# Altium project ZYNQ-7020-Core.PrjPcb (part 2 of 2)

## Sheet ZYNQ-JTAG.SchDoc
size A3; SheetNumber: 6; SheetTotal: 9
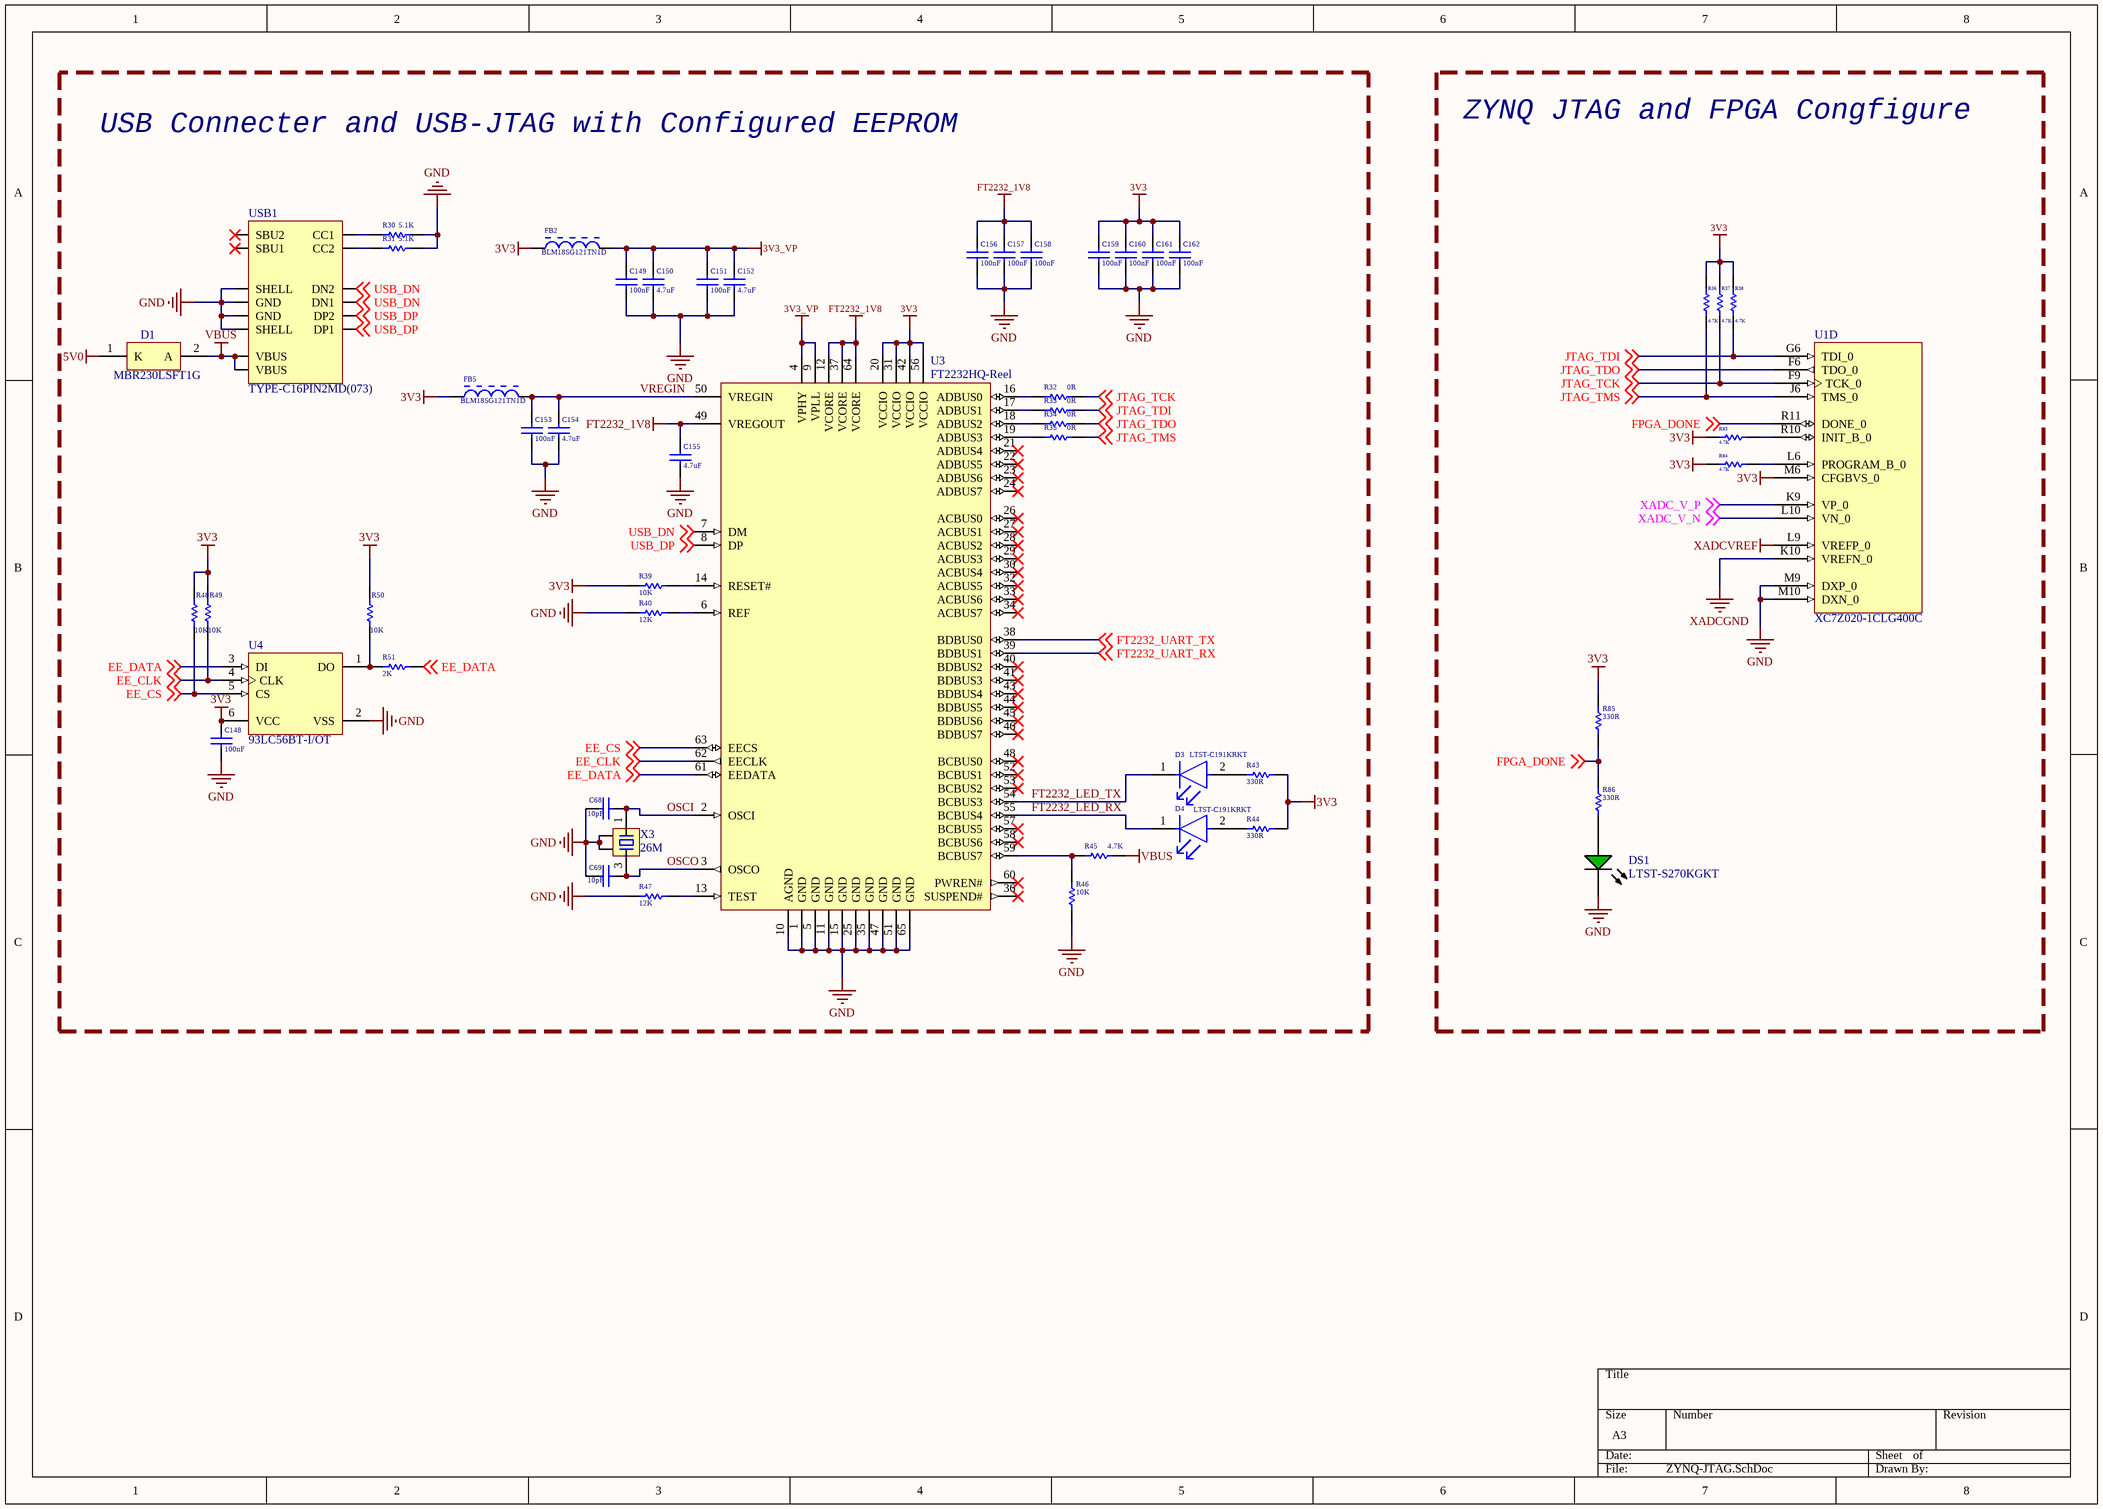
[diagram p5: ZYNQ-JTAG.SchDoc]

### Parts
C68  10pF  [CAPC1005X55X25LL05T10]
C69  10pF  [CAPC1005X55X25LL05T10]
C148  100nF  [CAPC1005X55X25LL05T10]
C149  100nF  [CAPC1005X55X25LL05T10]
C150  4.7uF  [CAPC1005X55X25LL05T10]
C151  100nF  [CAPC1005X55X25LL05T10]
C152  4.7uF  [CAPC1005X55X25LL05T10]
C153  100nF  [CAPC1005X55X25LL05T10]
C154  4.7uF  [CAPC1005X55X25LL05T10]
C155  4.7uF  [CAPC1005X55X25LL05T10]
C156  100nF  [CAPC1005X55X25LL05T10]
C157  100nF  [CAPC1005X55X25LL05T10]
C158  100nF  [CAPC1005X55X25LL05T10]
C159  100nF  [CAPC1005X55X25LL05T10]
C160  100nF  [CAPC1005X55X25LL05T10]
C161  100nF  [CAPC1005X55X25LL05T10]
C162  100nF  [CAPC1005X55X25LL05T10]
D1  MBR230LSFT1G  [ONSC-SOD-123FL-2-498-01_V]
D3  LTST-C191KRKT  [FP-LTST-C191KRKT-MFG]
D4  LTST-C191KRKT  [FP-LTST-C191KRKT-MFG]
DS1  LTST-S270KGKT  [LTST-LTST-S270KGKT-2_V]
FB2  BLM18SG121TN1D  [MURA-BLM18SG-B40-CHIP-2_V6]
FB5  BLM18SG121TN1D  [MURA-BLM18SG-B40-CHIP-2_V6]
R30  5.1K  [RESC1005X40X25LL05T05]
R31  5.1K  [RESC1005X40X25LL05T05]
R32  0R  [RESC1005X40X25LL05T05]
R33  0R  [RESC1005X40X25LL05T05]
R34  0R  [RESC1005X40X25LL05T05]
R35  0R  [RESC1005X40X25LL05T05]
R36  4.7K  [RESC1005X40X25LL05T05]
R37  4.7K  [RESC1005X40X25LL05T05]
R38  4.7K  [RESC1005X40X25LL05T05]
R39  10K  [RESC1005X40X25LL05T05]
R40  12K  [RESC1005X40X25LL05T05]
R43  330R  [RESC1005X40X25LL05T05]
R44  330R  [RESC1005X40X25LL05T05]
R45  4.7K  [RESC1005X40X25LL05T05]
R46  10K  [RESC1005X40X25LL05T05]
R47  12K  [RESC1005X40X25LL05T05]
R48  10K  [RESC1005X40X25LL05T05]
R49  10K  [RESC1005X40X25LL05T05]
R50  10K  [RESC1005X40X25LL05T05]
R51  2K  [RESC1005X40X25LL05T05]
R83  4.7K  [RESC1005X40X25LL05T05]
R84  4.7K  [RESC1005X40X25LL05T05]
R85  330R  [RESC1005X40X25LL05T05]
R86  330R  [RESC1005X40X25LL05T05]
U1  XC7Z020-1CLG400C  [CLG400]  (part D of 9)
U3  FT2232HQ-Reel  [QFN64_2_L]
U4  93LC56BT-I/OT  [SOT-23-OT6_N]
USB1  TYPE-C16PIN2MD(073)  [TYPE-C16PIN2MD(073)-Footprint]
X3  26M  [XTAL-3225-4P]

### Blocks framed on the sheet
USB Connecter and USB-JTAG with Configured EEPROM: C68 C69 C148-C162 D1 D3 D4 FB2 FB5 R30-R35 R39 R40 R43-R51 U3 U4 USB1 X3
ZYNQ JTAG and FPGA Congfigure: DS1 R36-R38 R83-R86 U1

### Nets
3V3: C148.1 C159.1 C160.1 C161.1 C162.1 FB2.1 FB5.1 R36.1 R37.1 R38.1 R39.2 R43.1 R44.1 R48.2 R49.2 R50.2 R83.1 R84.1 R85.2 U1.M6(CFGBVS_0) U3.20(VCCIO) U3.31(VCCIO) U3.42(VCCIO) U3.56(VCCIO) U4.6(VCC)
3V3_VP: C149.1 C150.1 C151.1 C152.1 FB2.2 U3.4(VPHY) U3.9(VPLL)
5V0: D1.1(K)
FT2232_1V8: C155.1 C156.1 C157.1 C158.1 U3.12(VCORE) U3.37(VCORE) U3.49(VREGOUT) U3.64(VCORE)
GND: C68.2 C69.2 C148.2 C149.2 C150.2 C151.2 C152.2 C153.2 C154.2 C155.2 C156.2 C157.2 C158.2 C159.2 C160.2 C161.2 C162.2 DS1.1(K) R30.1 R31.1 R40.1 R46.1 R47.1 U1.M9(DXP_0) U1.M10(DXN_0) U3.1(GND) U3.5(GND) U3.10(AGND) U3.11(GND) U3.15(GND) U3.25(GND) U3.35(GND) U3.47(GND) U3.51(GND) U3.65(GND) U4.2(VSS) USB1.1(GND) USB1.12(GND) USB1.13(SHELL) USB1.14(SHELL) X3.2 X3.4
VBUS: D1.2(A) R45.2 USB1.2(VBUS) USB1.11(VBUS)
XADCGND: U1.K10(VREFN_0)
XADCVREF: U1.L9(VREFP_0)
EE_CLK: R49.1 U3.62(EECLK) U4.4(CLK) ; off-sheet EE_CLK
EE_CS: R48.1 U3.63(EECS) U4.5(CS) ; off-sheet EE_CS
EE_DATA: R51.1 U3.61(EEDATA) U4.3(DI) ; off-sheet EE_DATA
FPGA_DONE: R85.1 R86.2 U1.R11(DONE_0) ; off-sheet FPGA_DONE
FT2232_LED_RX: D4.1(C) U3.55(BCBUS4)
FT2232_LED_TX: D3.1(C) U3.54(BCBUS3)
FT2232_UART_RX: U3.39(BDBUS1) ; off-sheet FT2232_UART_RX
FT2232_UART_TX: U3.38(BDBUS0) ; off-sheet FT2232_UART_TX
JTAG_TCK: R32.2 R37.2 U1.F9(TCK_0) ; off-sheet JTAG_TCK
JTAG_TDI: R33.2 R38.2 U1.G6(TDI_0) ; off-sheet JTAG_TDI
JTAG_TDO: R34.2 U1.F6(TDO_0) ; off-sheet JTAG_TDO
JTAG_TMS: R35.2 R36.2 U1.J6(TMS_0) ; off-sheet JTAG_TMS
OSCI: C68.1 U3.2(OSCI) X3.1
OSCO: C69.1 U3.3(OSCO) X3.3
USB_DN: U3.7(DM) USB1.5(DN2) USB1.7(DN1) ; off-sheet USB_DN
USB_DP: U3.8(DP) USB1.6(DP1) USB1.8(DP2) ; off-sheet USB_DP
VREGIN: C153.1 C154.1 FB5.2 U3.50(VREGIN)
XADC_V_N: U1.L10(VN_0) ; off-sheet XADC_V_N
XADC_V_P: U1.K9(VP_0) ; off-sheet XADC_V_P
NetD3_2: D3.2(A) R43.2
NetD4_2: D4.2(A) R44.2
NetDS1_2: DS1.2(A) R86.1
NetR30_2: R30.2 USB1.4(CC1)
NetR31_2: R31.2 USB1.10(CC2)
NetR32_1: R32.1 U3.16(ADBUS0)
NetR33_1: R33.1 U3.17(ADBUS1)
NetR34_1: R34.1 U3.18(ADBUS2)
NetR35_1: R35.1 U3.19(ADBUS3)
NetR39_1: R39.1 U3.14(RESET#)
NetR40_2: R40.2 U3.6(REF)
NetR45_1: R45.1 R46.2 U3.59(BCBUS7)
NetR47_2: R47.2 U3.13(TEST)
NetR50_1: R50.1 R51.2 U4.1(DO)
NetR83_2: R83.2 U1.R10(INIT_B_0)
NetR84_2: R84.2 U1.L6(PROGRAM_B_0)

Not connected (* = marked no-connect by the designer): U3 21(ADBUS4)* 22(ADBUS5)* 23(ADBUS6)* 24(ADBUS7)* 26(ACBUS0)* 27(ACBUS1)* 28(ACBUS2)* 29(ACBUS3)* 30(ACBUS4)* 32(ACBUS5)* 33(ACBUS6)* 34(ACBUS7)* 36(SUSPEND#)* 40(BDBUS2)* 41(BDBUS3)* 43(BDBUS4)* 44(BDBUS5)* 45(BDBUS6)* 46(BDBUS7)* 48(BCBUS0)* 52(BCBUS1)* 53(BCBUS2)* 57(BCBUS5)* 58(BCBUS6)* 60(PWREN#)*; USB1 3(SBU2)* 9(SBU1)*

### Library data of the parts
C68 C69 C148-C162 = CMP-2008-04639-1: Part Number: GRM155R71H104KE14D; Manufacturer: Murata
D1 = CMP-1055-00442-1: Schottky Power Rectifier, 2-Pin SOD-123, Pb-Free, Tape and Reel; Manufacturer: On Semiconductor; Configuration: Single; IFSM Max (A): 40; ComponentLink2Description: Datasheet; DatasheetVersion: Rev. 0; ComponentLink1URL: http://www.onsemi.com/; ComponentLink2URL: http://www.onsemi.cn/pub_link/Collateral/MBR230LSFT1G.PDF; ComponentLink3Description: Package Specification; PackageDescription: 2-Pin SOD, Body 1.65 x 2.7 mm; RoHS: TRUE; PackageVersion: Rev. A; Mounting Technology: Surface Mount; ComponentLink3URL: http://www.onsemi.cn/pub_link/Collateral/MBR120VLSFT1-D.PDF; ComponentLink1Description: Manufacturer URL; Packing: Tape and Reel; PackageReference: SOD-123FL-2-498-01; PartNumber: MBR230LSFT1G
D3 D4 = CMP-2000-05199-2
DS1 = CMP-2000-06629-1: Ultra Bright AlInGaP Chip LED, 75 mW, -30 to 85 degC, 2-Pin SMD (0604), RoHS, Tape and Reel; Manufacturer: Lite-On; Luminous Intensity: 71mcd; Reverse Voltage: 5V; Power Dissipation: 75W; Viewing Angle: 130deg; Shape Type: Rectangular; DELETED: Compliant; Type: Uni-Color; Peak Wavelength: 574nm; Forward Current Max: 30mA; Emitting Color: YellowGreen; Number of  Elements: 1; Forward Voltage: 2.4V; Product Depth (mm): 0.6mm; Power Dissipation Max: 75mW; Dominant Wave Length: 571nm; Product Length (mm): 1.6mm; Chip Material: AlGaInP; Product Height (mm): 1.15mm; Rad Hardened: No; High Brightness: Yes; Test Current (It): 20mA; Main Category: ChipLED; Mounting: SurfaceMount; Operating Temperature Classification: Industrial; Mounting Technology: SurfaceMount; Packaging: TapeandReel; Datasheet URL: http://optoelectronics.liteon.com/upload/download/DS22-2000-226/S_110_LTST-S270KGKT.pdf; Package Type: ChipLed; Datasheet Version: Rev. I, 04/2012; Forward Current: 30mA; Operating Temp Range: -55Cto85C; Lens Dimensions: 1.2X0.6X0.47mm; Pin Count: 2; Manufacturer URL: http://www.us.liteon.com/; Lum Intensity: 71mcd; Package Reference: LTST-S270KGKT-2; Package Description: 2-Pin Surface Mounted Device, Body 1.65 x 0.6 mm
FB2 FB5 = CMP-0686-00602-3: Chip Ferrite Bead for Power Lines (Low DC Resistance Type), 120 Ohm, 3000 mA, -55 to 125 degC, 1.6 x 0.8 x 0.65 mm SMD, Tape and Reel; Manufacturer: Murata; Impedance (at 100 MHz): 120 Ohm +/- 25%; Rated Current: 3000 mA; DC Resistance: 0.025 Ohm Max.; ComponentLink3Description: Package Specification; PackageReference: BLM18_H650-2; DatasheetVersion: 08/2013; Packing: Tape and Reel; PartNumber: BLM18SG121TN1D; PackageDescription: 2-Pin Chip, Body 1.6 x 0.8 mm; ComponentLink2Description: Datasheet; ComponentLink3URL: http://www.murata.com/products/catalog/pdf/c31e.pdf; ComponentLink1URL: http://www.murata.com/; Operating Temperature Range: -55 to 125 degC; Mounting Technology: Surface Mount; ComponentLink2URL: http://www.murata.com/products/catalog/pdf/c31e.pdf; ComponentLink1Description: Manufacturer URL
R30-R40 R43-R51 R83-R86 = CMP-2002-00921-1: Manufacturer: Panasonic; Part Number: ERJ-2RKF40R2X
U1 = CMP-0363-00002-3: 667 MHz Zynq™-7000 AP SoC, 130 PS I/O, 125 FPGA I/O, 400-Ball BGA, Speed Grade 1, Commercial Grade, Pb-Free; Flip Flops: 106400; Speed Grade: -1; LUTs: 53200; Extensible Block RAM (# 36Kb Blocks): 560 KB (140); PackageVersion: Rev 1.1, 09/2012; ComponentLink1Description: Datasheet; ComponentLink2Description: Package Specification; ComponentLink6Description: PCB and Layout Guide; PackageDescription: Wire-Bond Chip-Scale BGA, Body 17 x 17 mm, 0.8 mm Pitch; RoHS: Pb-Free; DatasheetVersion: v1.2; Mounting Technology: Surface Mount; ComponentLink5Description: Packaging and Pinout; ComponentLink5URL: http://www.xilinx.com/support/documentation/user_guides/ug865-Zynq-7000-Pkg-Pinout.pdf; ComponentLink6URL: http://www.xilinx.com/support/documentation/user_guides/ug483_7Series_PCB.pdf; Generic Part Number: XC7Z020; ComponentLink3Description: DC and AC Switching Characteristics; ComponentLink2URL: http://www.xilinx.com/support/documentation/user_guides/ug865-Zynq-7000-Pkg-Pinout.pdf; ComponentLink4Description: Package File; ComponentLink1URL: http://www.xilinx.com/support/documentation/data_sheets/ds190-Zynq-7000-Overview.pdf; PackageReference: CLG400; ComponentLink3URL: http://www.xilinx.com/support/documentation/data_sheets/ds187-XC7Z010-XC7Z020-Data-Sheet.pdf; PartNumber: XC7Z020-1CLG400C; ComponentLink4URL: http://www.xilinx.com/support/packagefiles/z7packages/xc7z020clg400pkg.txt; Code_JEDEC: MO-275-MMAA-1
U3 = CMP-0078-00004-3: Dual High Speed USB To Multipurpose UART/FIFO IC, 64-pin QFN, Tape and Reel; Manufacturer: FTDI; ComponentLink2Description: Datasheet; RevisionNote: DatasheetVersion updated to 2.21 Jun-2012; ComponentLink2URL: http://www.ftdichip.com/Support/Documents/DataSheets/ICs/DS_FT2232H.pdf; PackageReference: QFN64_2; ComponentLink1Description: Manufacturer URL; PackageDescription: 64-Pin Quad Flat No-Lead, 9 x 9 mm Body, 0.5 mm Pitch, 4.35 x 4.35 mm Exposed Pad; PackageVersion: Jun-12; DatasheetVersion: ver 2.21, Jun-2012; PartNumber: FT2232HQ-Reel; ComponentLink1URL: http://www.ftdichip.com/
U4 = CMP-0162-00356-1: 2K, 128x16-bit, 2.5V Microwire Serial EEPROM, 6-Pin SOT-23, Industrial Temperature, Tape and Reel; DatasheetVersion: revF, May-2008; Code_IPC: SOT26A-6; PackageReference: SOT-23-OT6; PackageVersion: revBB, Aug-2009; PackageDescription: 6-Lead Plastic Small Outline Transistor (OT) [SOT-23]
USB1 = CMP-00018-3: Type-C 母 卧贴 带定位柱 不锈钢外壳 2次模顶; 商品目录: USB连接器; 触点数量: 16P; 额定电流 - 电源: 5A; 端口数量: 1; 工作温度范围: -25℃~+85℃; 公母: 母; 安装方式: 卧贴; 连接器类型: Type-C; 标准: -
X3 = XTAL-4P: 4脚无源晶振(谐振器）; 联系下单店铺卖家 免费帮你查找封装: 联系下单店铺卖家 免费技术支持; BOM名称: 4脚无源晶振(谐振器）

## Sheet Board-Power.SchDoc
size A3; SheetNumber: 7; SheetTotal: 9
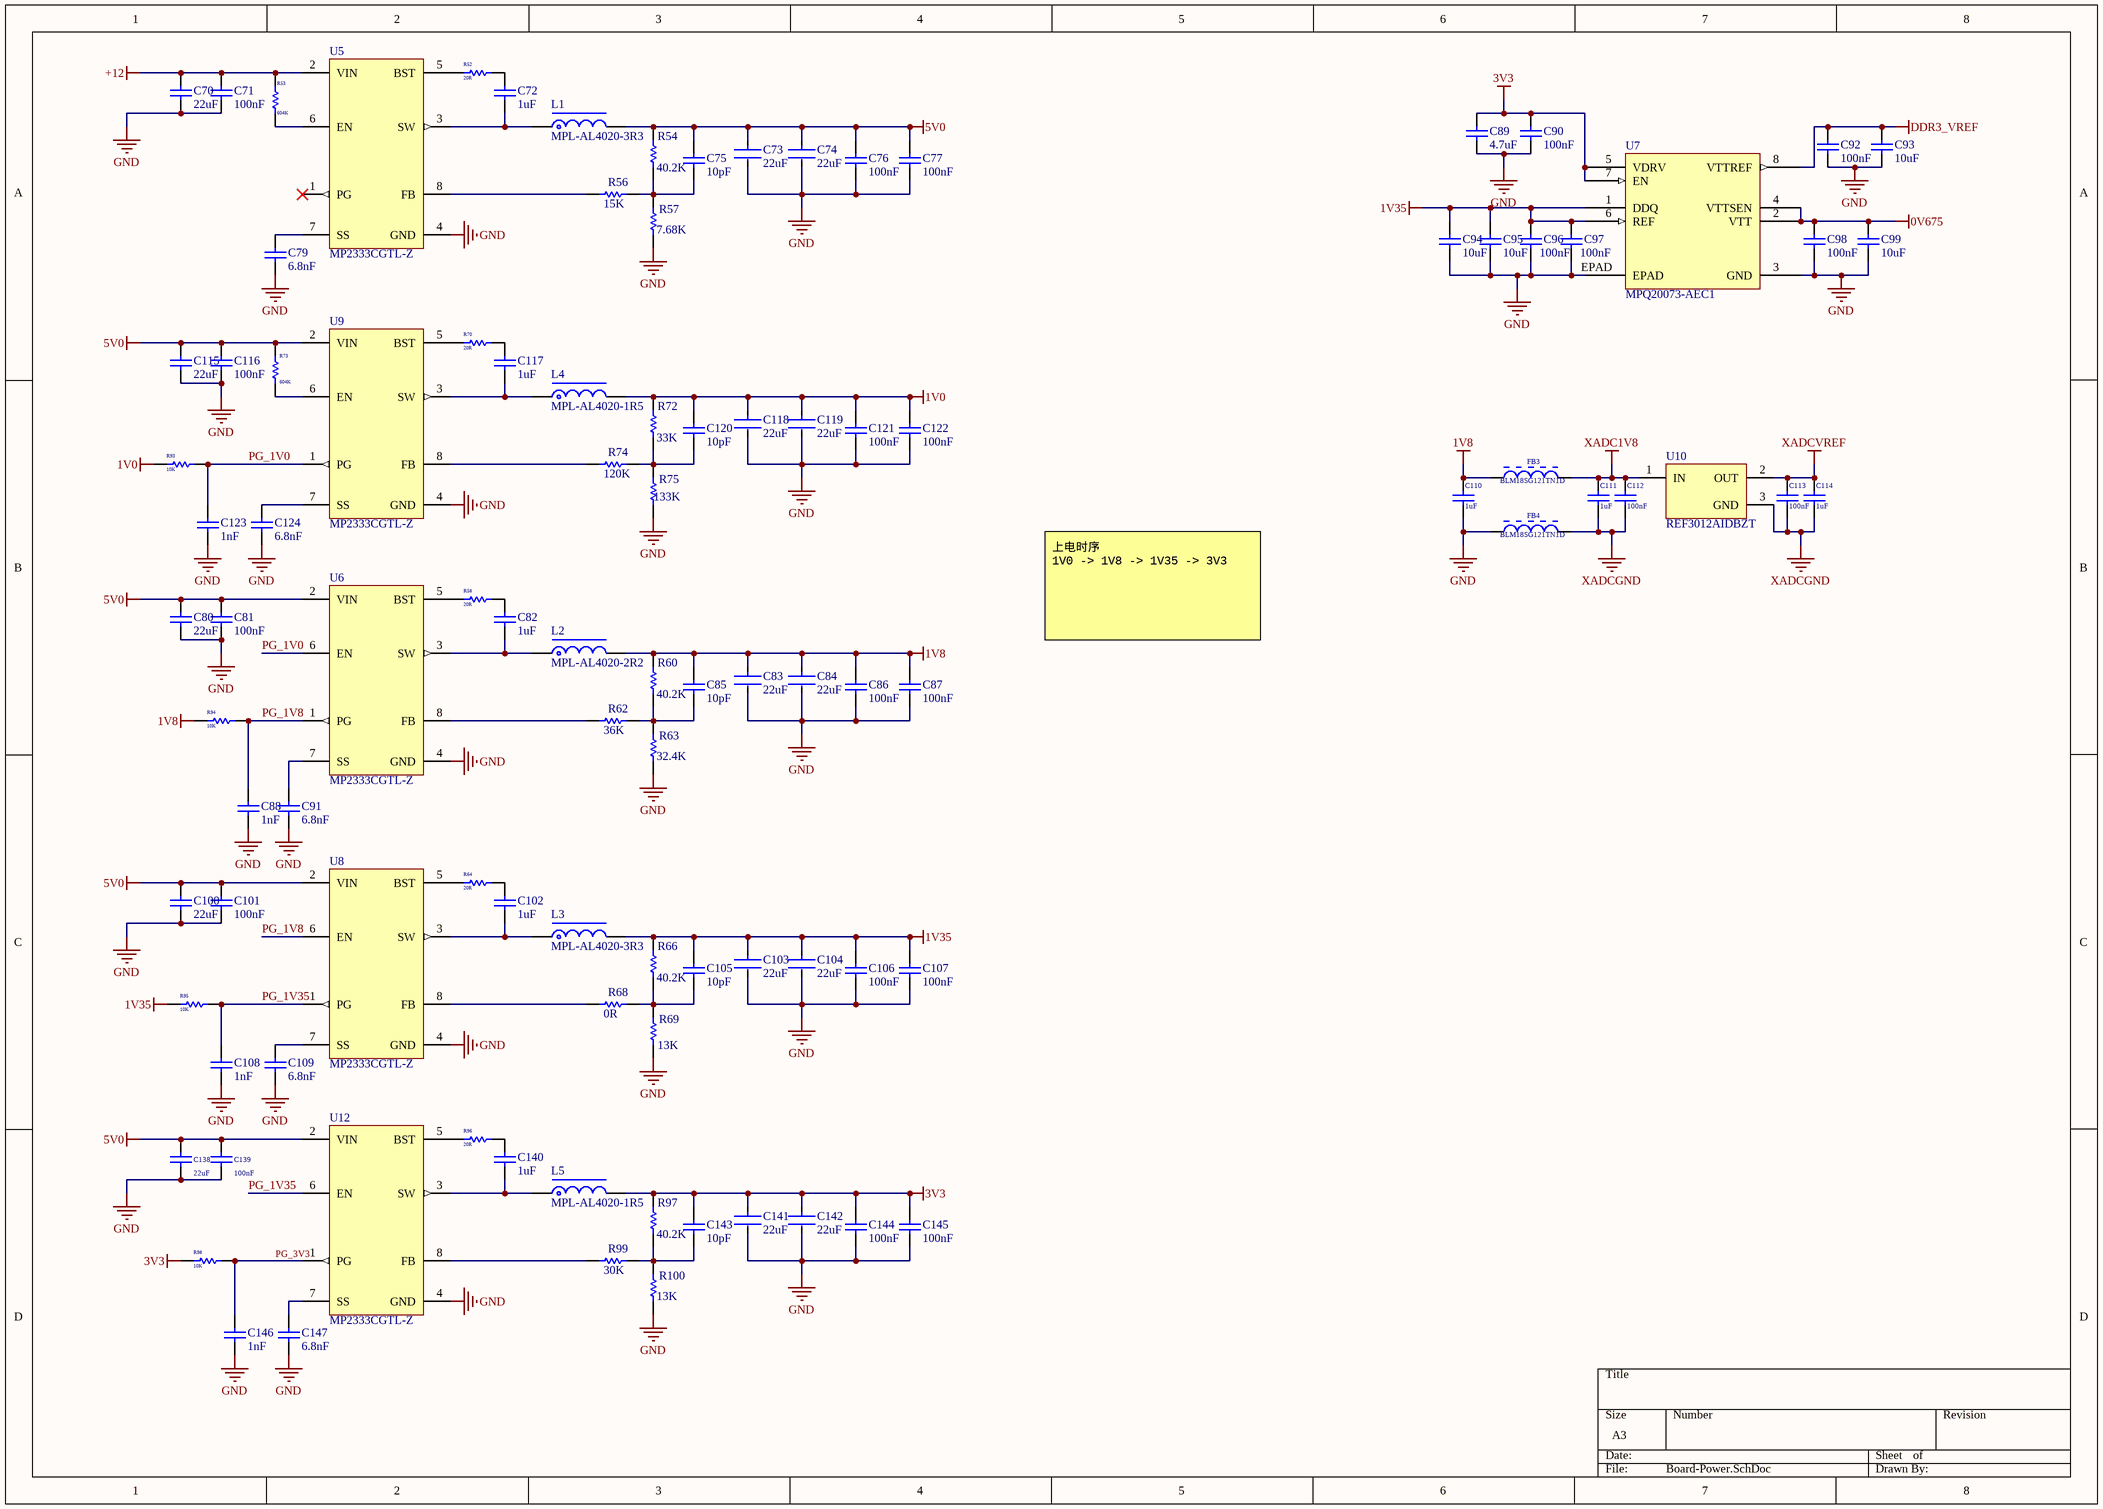
[diagram p6: Board-Power.SchDoc]

### Parts
C70  22uF  [CAPC2013X145X45LL20T25]
C71  100nF  [CAPC1005X55X25LL05T10]
C72  1uF  [CAPC1005X55X25LL05T10]
C73  22uF  [FP-GCM31C-0_2-e0_3_0_8-IPC_C]
C74  22uF  [FP-GCM31C-0_2-e0_3_0_8-IPC_C]
C75  10pF  [CAPC1005X55X25LL05T10]
C76  100nF  [CAPC1005X55X25LL05T10]
C77  100nF  [CAPC1005X55X25LL05T10]
C79  6.8nF  [CAPC1005X55X25LL05T10]
C80  22uF  [CAPC2013X145X45LL20T25]
C81  100nF  [CAPC1005X55X25LL05T10]
C82  1uF  [CAPC1005X55X25LL05T10]
C83  22uF  [FP-GCM31C-0_2-e0_3_0_8-IPC_C]
C84  22uF  [FP-GCM31C-0_2-e0_3_0_8-IPC_C]
C85  10pF  [CAPC1005X55X25LL05T10]
C86  100nF  [CAPC1005X55X25LL05T10]
C87  100nF  [CAPC1005X55X25LL05T10]
C88  1nF  [CAPC1005X55X25LL05T10]
C89  4.7uF  [CAPC1005X55X25LL05T10]
C90  100nF  [CAPC1005X55X25LL05T10]
C91  6.8nF  [CAPC1005X55X25LL05T10]
C92  100nF  [CAPC1005X55X25LL05T10]
C93  10uF  [MURA-1206_H_1.8_L]
C94  10uF  [MURA-1206_H_1.8_L]
C95  10uF  [MURA-1206_H_1.8_L]
C96  100nF  [CAPC1005X55X25LL05T10]
C97  100nF  [CAPC1005X55X25LL05T10]
C98  100nF  [CAPC1005X55X25LL05T10]
C99  10uF  [MURA-1206_H_1.8_L]
C100  22uF  [CAPC2013X145X45LL20T25]
C101  100nF  [CAPC1005X55X25LL05T10]
C102  1uF  [CAPC1005X55X25LL05T10]
C103  22uF  [FP-GCM31C-0_2-e0_3_0_8-IPC_C]
C104  22uF  [FP-GCM31C-0_2-e0_3_0_8-IPC_C]
C105  10pF  [CAPC1005X55X25LL05T10]
C106  100nF  [CAPC1005X55X25LL05T10]
C107  100nF  [CAPC1005X55X25LL05T10]
C108  1nF  [CAPC1005X55X25LL05T10]
C109  6.8nF  [CAPC1005X55X25LL05T10]
C110  1uF  [CAPC1005X55X25LL05T10]
C111  1uF  [CAPC1005X55X25LL05T10]
C112  100nF  [CAPC1005X55X25LL05T10]
C113  100nF  [CAPC1005X55X25LL05T10]
C114  1uF  [CAPC1005X55X25LL05T10]
C115  22uF  [CAPC2013X145X45LL20T25]
C116  100nF  [CAPC1005X55X25LL05T10]
C117  1uF  [CAPC1005X55X25LL05T10]
C118  22uF  [FP-GCM31C-0_2-e0_3_0_8-IPC_C]
C119  22uF  [FP-GCM31C-0_2-e0_3_0_8-IPC_C]
C120  10pF  [CAPC1005X55X25LL05T10]
C121  100nF  [CAPC1005X55X25LL05T10]
C122  100nF  [CAPC1005X55X25LL05T10]
C123  1nF  [CAPC1005X55X25LL05T10]
C124  6.8nF  [CAPC1005X55X25LL05T10]
C138  22uF  [CAPC2013X145X45LL20T25]
C139  100nF  [CAPC1005X55X25LL05T10]
C140  1uF  [CAPC1005X55X25LL05T10]
C141  22uF  [FP-GCM31C-0_2-e0_3_0_8-IPC_C]
C142  22uF  [FP-GCM31C-0_2-e0_3_0_8-IPC_C]
C143  10pF  [CAPC1005X55X25LL05T10]
C144  100nF  [CAPC1005X55X25LL05T10]
C145  100nF  [CAPC1005X55X25LL05T10]
C146  1nF  [CAPC1005X55X25LL05T10]
C147  6.8nF  [CAPC1005X55X25LL05T10]
FB3  BLM18SG121TN1D  [MURA-BLM18SG-B40-CHIP-2_V6]
FB4  BLM18SG121TN1D  [MURA-BLM18SG-B40-CHIP-2_V6]
L1  MPL-AL4020-3R3  [MPL-AL4020]
L2  MPL-AL4020-2R2  [MPL-AL4020]
L3  MPL-AL4020-3R3  [MPL-AL4020]
L4  MPL-AL4020-1R5  [MPL-AL4020]
L5  MPL-AL4020-1R5  [MPL-AL4020]
R52  20R  [RESC1005X40X25LL05T05]
R53  604K  [RESC1005X40X25LL05T05]
R54  40.2K  [RESC1005X40X25LL05T05]
R56  15K  [RESC1005X40X25LL05T05]
R57  7.68K  [RESC1005X40X25LL05T05]
R58  20R  [RESC1005X40X25LL05T05]
R60  40.2K  [RESC1005X40X25LL05T05]
R62  36K  [RESC1005X40X25LL05T05]
R63  32.4K  [RESC1005X40X25LL05T05]
R64  20R  [RESC1005X40X25LL05T05]
R66  40.2K  [RESC1005X40X25LL05T05]
R68  0R  [RESC1005X40X25LL05T05]
R69  13K  [RESC1005X40X25LL05T05]
R70  20R  [RESC1005X40X25LL05T05]
R72  33K  [RESC1005X40X25LL05T05]
R73  604K  [RESC1005X40X25LL05T05]
R74  120K  [RESC1005X40X25LL05T05]
R75  133K  [RESC1005X40X25LL05T05]
R93  10K  [RESC1005X40X25LL05T05]
R94  10K  [RESC1005X40X25LL05T05]
R95  10K  [RESC1005X40X25LL05T05]
R96  20R  [RESC1005X40X25LL05T05]
R97  40.2K  [RESC1005X40X25LL05T05]
R98  10K  [RESC1005X40X25LL05T05]
R99  30K  [RESC1005X40X25LL05T05]
R100  13K  [RESC1005X40X25LL05T05]
U5  MP2333CGTL-Z  [SOT583_MP2333C_MNP]
U6  MP2333CGTL-Z  [SOT583_MP2333C_MNP]
U7  MPQ20073-AEC1  [MSOP-8-EP_MNP-L]
U8  MP2333CGTL-Z  [SOT583_MP2333C_MNP]
U9  MP2333CGTL-Z  [SOT583_MP2333C_MNP]
U10  REF3012AIDBZT  [DBZ0003A_L]
U12  MP2333CGTL-Z  [SOT583_MP2333C_MNP]

### Nets
0V675: C98.2 C99.2 U7.2(VTT) U7.4(VTTSEN)
1V0: C118.1 C119.1 C120.2 C121.2 C122.2 L4.2 R72.1 R93.2
1V8: C83.1 C84.1 C85.2 C86.2 C87.2 C110.2 FB3.1 L2.2 R60.1 R94.2
1V35: C94.2 C95.2 C96.2 C97.2 C103.1 C104.1 C105.2 C106.2 C107.2 L3.2 R66.1 R95.2 U7.1(DDQ) U7.6(REF)
3V3: C89.2 C90.2 C141.1 C142.1 C143.2 C144.2 C145.2 L5.2 R97.1 R98.2 U7.5(VDRV) U7.7(EN)
5V0: C73.1 C74.1 C75.2 C76.2 C77.2 C80.2 C81.2 C100.2 C101.2 C115.2 C116.2 C138.2 C139.2 L1.2 R54.1 R73.2 U6.2(VIN) U8.2(VIN) U9.2(VIN) U12.2(VIN)
+12: C70.2 C71.2 R53.2 U5.2(VIN)
DDR3_VREF: C92.2 C93.2 U7.8(VTTREF)
GND: C70.1 C71.1 C73.2 C74.2 C76.1 C77.1 C79.2 C80.1 C81.1 C83.2 C84.2 C86.1 C87.1 C88.2 C89.1 C90.1 C91.2 C92.1 C93.1 C94.1 C95.1 C96.1 C97.1 C98.1 C99.1 C100.1 C101.1 C103.2 C104.2 C106.1 C107.1 C108.2 C109.2 C110.1 C115.1 C116.1 C118.2 C119.2 C121.1 C122.1 C123.2 C124.2 C138.1 C139.1 C141.2 C142.2 C144.1 C145.1 C146.2 C147.2 FB4.1 R57.2 R63.2 R69.2 R75.2 R100.2 U5.4(GND) U6.4(GND) U7.3(GND) U7.EPAD U8.4(GND) U9.4(GND) U12.4(GND)
XADC1V8: C111.2 C112.2 FB3.2 U10.1(IN)
XADCGND: C111.1 C112.1 C113.1 C114.1 FB4.2 U10.3(GND)
XADCVREF: C113.2 C114.2 U10.2(OUT)
PG_1V0: C123.1 R93.1 U6.6(EN) U9.1(PG)
PG_1V8: C88.1 R94.1 U6.1(PG) U8.6(EN)
PG_1V35: C108.1 R95.1 U8.1(PG) U12.6(EN)
PG_3V3: C146.1 R98.1 U12.1(PG)
NetC72_1: C72.1 L1.1 U5.3(SW)
NetC72_2: C72.2 R52.1
NetC75_1: C75.1 R54.2 R56.2 R57.1
NetC79_1: C79.1 U5.7(SS)
NetC82_1: C82.1 L2.1 U6.3(SW)
NetC82_2: C82.2 R58.1
NetC85_1: C85.1 R60.2 R62.2 R63.1
NetC91_1: C91.1 U6.7(SS)
NetC102_1: C102.1 L3.1 U8.3(SW)
NetC102_2: C102.2 R64.1
NetC105_1: C105.1 R66.2 R68.2 R69.1
NetC109_1: C109.1 U8.7(SS)
NetC117_1: C117.1 L4.1 U9.3(SW)
NetC117_2: C117.2 R70.1
NetC120_1: C120.1 R72.2 R74.2 R75.1
NetC124_1: C124.1 U9.7(SS)
NetC140_1: C140.1 L5.1 U12.3(SW)
NetC140_2: C140.2 R96.1
NetC143_1: C143.1 R97.2 R99.2 R100.1
NetC147_1: C147.1 U12.7(SS)
NetR52_2: R52.2 U5.5(BST)
NetR53_1: R53.1 U5.6(EN)
NetR56_1: R56.1 U5.8(FB)
NetR58_2: R58.2 U6.5(BST)
NetR62_1: R62.1 U6.8(FB)
NetR64_2: R64.2 U8.5(BST)
NetR68_1: R68.1 U8.8(FB)
NetR70_2: R70.2 U9.5(BST)
NetR73_1: R73.1 U9.6(EN)
NetR74_1: R74.1 U9.8(FB)
NetR96_2: R96.2 U12.5(BST)
NetR99_1: R99.1 U12.8(FB)

Not connected (* = marked no-connect by the designer): U5 1(PG)*

### Notes on the sheet
- 上电时序
  1V0 -> 1V8 -> 1V35 -> 3V3

### Library data of the parts
C70 C80 C100 C115 C138 = CMP-2007-03222-1: GRM21BR61E226ME44L; Manufacturer: Murata; Part Number: GRM21BR61E226ME44L
C71 C72 C75-C77 C79 C81 C82 C85-C92 C96-C98 C101 C102 C105-C114 C116 C117 C120-C124 C139 C140 C143-C147 = CMP-2008-04639-1: as C68 on sheet ZYNQ-JTAG
C73 C74 C83 C84 C103 C104 C118 C119 C141 C142 = CMP-00080-1: GCM31CR71A226KE02K / Cap, Aec-Q200, 22Uf, 10V, Mlcc, 1206 Rohs Compliant: Yes; RoHS Compliant: Yes
C93-C95 C99 = CMP-2000-05256-1: GRM31CR61H106KA12L / CAP, Ceramic, 10 uF, 10%, 50 V, 1206, RoHS, Tape and Reel; Manufacturer: Murata; Dielectric: X5R; Case Height: 1.6mm; Type: GeneralPurposeMLCC; Voltage Rating DC: 50V; Brand: MurataElectronics; Case Length: 3.2mm; Case Code - mm: 3216; Manufacturer URL: http://www.murata.com/; Product: GeneralTypeMLCCs; RoHS: Details; Minimum Operating Temperature: -55C; Factory Pack Quantity: 2000; Maximum Operating Temperature: +85C; Case Width: 1.6mm; Series: GRM; Package / Case: 1206(3216metric); Tolerance: 10%; Capacitance: 10uF; Datasheet URL: http://download.siliconexpert.com/pdfs/2015/11/6/15/23/32/328/mrt_/manual/2905595417290350grm31cr61h106ka1223.pdf; Product Category: MultilayerCeramicCapacitorsMLCC-SMD/SMT; Packaging: Reel; Termination Style: SMD/SMT; Datasheet Version: Nov-15; Case Code - in: 1206
FB3 FB4 = CMP-0686-00602-3: as FB2 on sheet ZYNQ-JTAG; ComponentLink3Description: Package Specification; PackageReference: BLM18_H650-2; DatasheetVersion: 08/2013; Packing: Tape and Reel; PartNumber: BLM18SG121TN1D; PackageDescription: 2-Pin Chip, Body 1.6 x 0.8 mm; ComponentLink2Description: Datasheet; ComponentLink3URL: http://www.murata.com/products/catalog/pdf/c31e.pdf; ComponentLink1URL: http://www.murata.com/; Operating Temperature Range: -55 to 125 degC; Mounting Technology: Surface Mount; ComponentLink2URL: http://www.murata.com/products/catalog/pdf/c31e.pdf; ComponentLink1Description: Manufacturer URL
L1-L5 = L-Molding Choke: 一体成型电感; 当前库版本V2023.5.31 @淘宝卖家:黄晶宝石: 最新版本发布https://item.taobao.com/item.htm?id=566775463719; BOM名称: 一体成型电感
R52-R54 R56-R58 R60 R62-R64 R66 R68-R70 R72-R75 R93-R100 = CMP-2002-00921-1: as R30 on sheet ZYNQ-JTAG
U5 U6 U8 U9 U12 = CMP-00056-5: Switching Voltage Regulators 3A, 18V, 650kHz, Force CCM, Synchronous Step-Down C
U7 = CMP-00079-2: 2A 1.3V–6.0V DDR Memory Termination Regulator AEC-Q100 Qualified
U10 = CMP-0367-00158-2: 1.25 V, 50 ppm / degC, 50 uA Series (Bandgap) Voltage Reference, -40 to 125 degC, 3-pin SOT-23 (DBZ), Green (RoHS & no Sb/Br); Manufacturer: Texas Instruments; Iq(Max)(uA): 50; Initial Accuracy @ 25/deg C(%): 0.2; Rating: Catalog; VI(Max)(V): 5.5; VI(Min)(V): 1.8; Temp Coeff(Typ)(ppm/ degree C): 20; SubFamily: Series Voltage Reference; VO(V): 1.25; ComponentLink1Description: Manufacturer URL; ComponentLink1URL: http://www.ti.com/; PartNumber: REF3012AIDBZT; PackageDescription: 3-Pin Plastic Small Outline, Body 2.92 x 1.3 mm, Pitch 0.95 mm; Mounting Technology: Surface Mount; Eco-Plan: Green (RoHS & no Sb/Br); PackageVersion: 4203227/B; ComponentLink2URL: http://www.ti.com/general/docs/lit/getliterature.tsp?genericPartNumber=REF3012&fileType=pdf; ComponentLink2Description: Datasheet; Temp Coeff(Max)(ppm/ degree C): 50; Code_JEDEC: TO-236; PackageReference: DBZ0003A; ComponentLink3Description: Package Specification; DatasheetVersion: SBVS032F; ComponentLink3URL: http://www.ti.com/litv/pdf/mpds108a

## Sheet Others.SchDoc
size A3; SheetNumber: 8; SheetTotal: 9
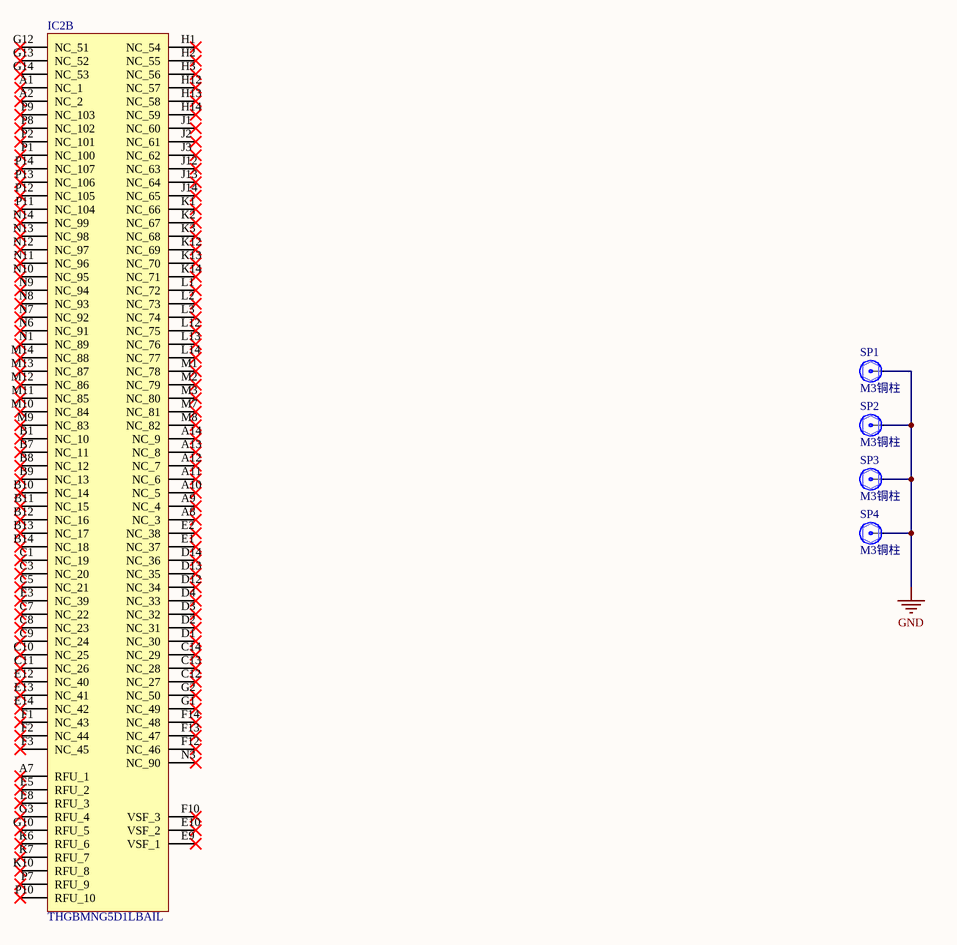
[diagram p7: Others.SchDoc]

### Parts
IC2  THGBMNG5D1LBAIL  [BGA153C50P14X14_1150X1300X80]  (part B of 2)
SP1  M3铜柱  [M3x4+6_L]
SP2  M3铜柱  [M3x4+6_L]
SP3  M3铜柱  [M3x4+6_L]
SP4  M3铜柱  [M3x4+6_L]

### Nets
GND: SP1.1 SP2.1 SP3.1 SP4.1

Not connected (* = marked no-connect by the designer): IC2 A1(NC_1)* A2(NC_2)* A7(RFU_1)* A8(NC_3)* A9(NC_4)* A10(NC_5)* A11(NC_6)* A12(NC_7)* A13(NC_8)* A14(NC_9)* B1(NC_10)* B7(NC_11)* B8(NC_12)* B9(NC_13)* B10(NC_14)* B11(NC_15)* B12(NC_16)* B13(NC_17)* B14(NC_18)* C1(NC_19)* C3(NC_20)* C5(NC_21)* C7(NC_22)* C8(NC_23)* C9(NC_24)* C10(NC_25)* C11(NC_26)* C12(NC_27)* C13(NC_28)* C14(NC_29)* D1(NC_30)* D2(NC_31)* D3(NC_32)* D4(NC_33)* D12(NC_34)* D13(NC_35)* D14(NC_36)* E1(NC_37)* E2(NC_38)* E3(NC_39)* E5(RFU_2)* E8(RFU_3)* E9(VSF_1)* E10(VSF_2)* E12(NC_40)* E13(NC_41)* E14(NC_42)* F1(NC_43)* F2(NC_44)* F3(NC_45)* F10(VSF_3)* F12(NC_46)* F13(NC_47)* F14(NC_48)* G1(NC_49)* G2(NC_50)* G3(RFU_4)* G10(RFU_5)* G12(NC_51)* G13(NC_52)* G14(NC_53)* H1(NC_54)* H2(NC_55)* H3(NC_56)* H12(NC_57)* H13(NC_58)* H14(NC_59)* J1(NC_60)* J2(NC_61)* J3(NC_62)* J12(NC_63)* J13(NC_64)* J14(NC_65)* K1(NC_66)* K2(NC_67)* K3(NC_68)* K6(RFU_6)* K7(RFU_7)* K10(RFU_8)* K12(NC_69)* K13(NC_70)* K14(NC_71)* L1(NC_72)* L2(NC_73)* L3(NC_74)* L12(NC_75)* L13(NC_76)* L14(NC_77)* M1(NC_78)* M2(NC_79)* M3(NC_80)* M7(NC_81)* M8(NC_82)* M9(NC_83)* M10(NC_84)* M11(NC_85)* M12(NC_86)* M13(NC_87)* M14(NC_88)* N1(NC_89)* N3(NC_90)* N6(NC_91)* N7(NC_92)* N8(NC_93)* N9(NC_94)* N10(NC_95)* N11(NC_96)* N12(NC_97)* N13(NC_98)* N14(NC_99)* P1(NC_100)* P2(NC_101)* P7(RFU_9)* P8(NC_102)* P9(NC_103)* P10(RFU_10)* P11(NC_104)* P12(NC_105)* P13(NC_106)* P14(NC_107)*

### Library data of the parts
IC2 = THGBMNG5D1LBAIL: Integrated Circuit; Manufacturer_Name: Toshiba; Datasheet Link: https://datasheet.lcsc.com/szlcsc/1906131632_TOSHIBA-THGBMNG5D1LBAIL_C391255.pdf; Height: 0.8mm; Manufacturer_Part_Number: THGBMNG5D1LBAIL; Mouser Part Number: N/A; Mouser Price/Stock: https://www.mouser.co.uk/ProductDetail/Toshiba/THGBMNG5D1LBAIL?qs=Znm5pLBrcAKyiWgFGEjr8Q%3D%3D
SP1-SP4 = 铜柱加头小焊盘: 铜柱; 联系下单店铺卖家 免费技术支持: 联系下单店铺卖家 免费帮你查找封装; BOM名称: 铜柱

## Sheet ZYNQ-Connecters.SchDoc
size A3; DrawnBy: WwWangGuan; SheetNumber: 9; SheetTotal: 9
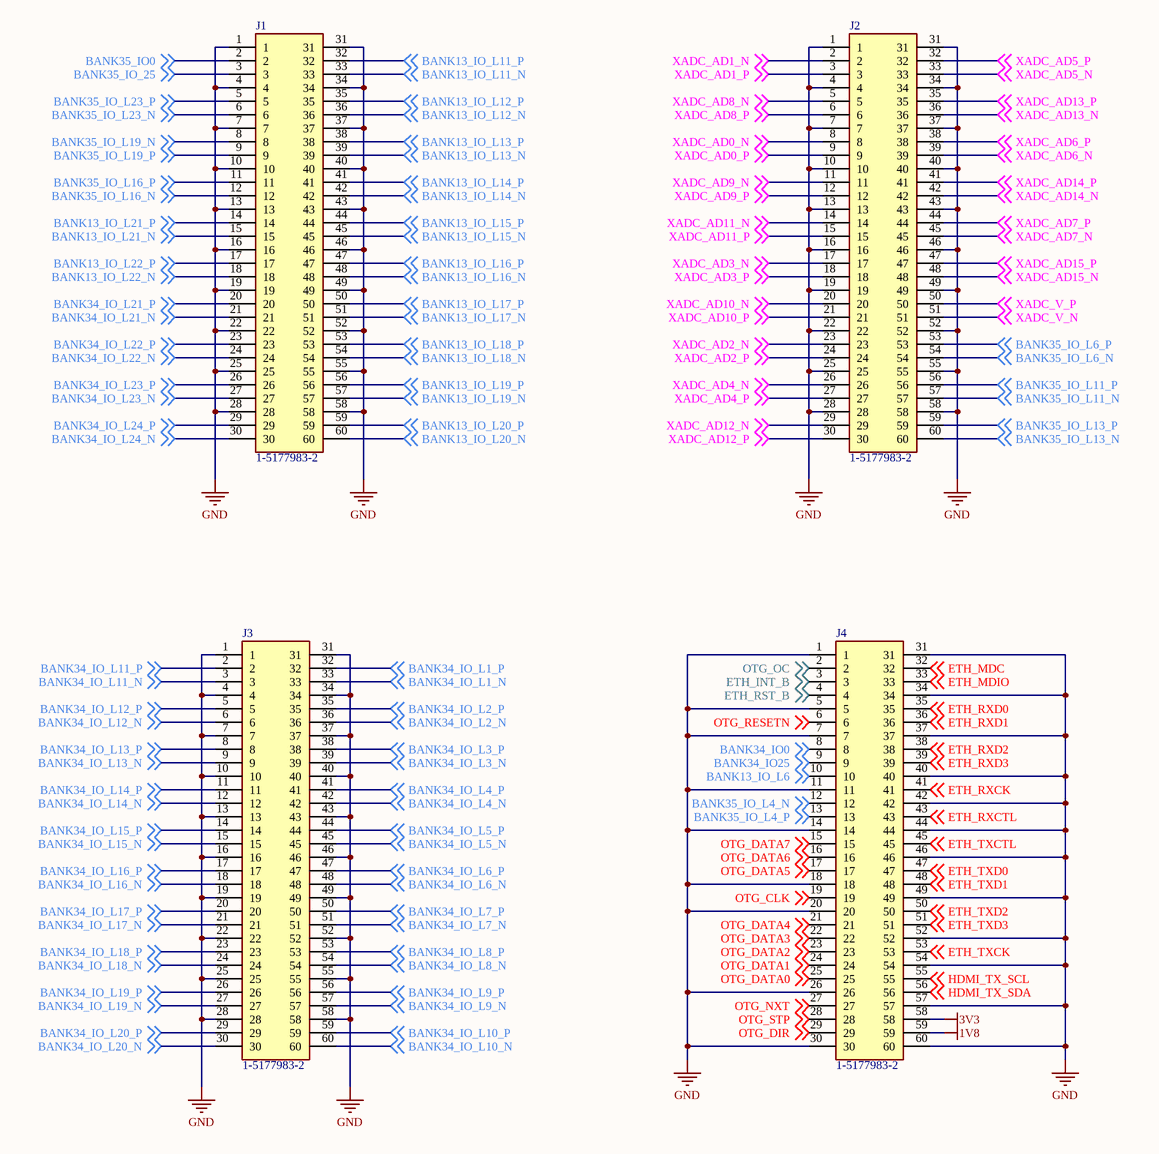
[diagram p8: ZYNQ-Connecters.SchDoc]

### Parts
J1  1-5177983-2  [5177983-2]
J2  1-5177983-2  [5177983-2]
J3  1-5177983-2  [5177983-2]
J4  1-5177983-2  [5177983-2]

### Nets
1V8: J4.59
3V3: J4.58
GND: J1.1 J1.4 J1.7 J1.10 J1.13 J1.16 J1.19 J1.22 J1.25 J1.28 J1.31 J1.34 J1.37 J1.40 J1.43 J1.46 J1.49 J1.52 J1.55 J1.58 J2.1 J2.4 J2.7 J2.10 J2.13 J2.16 J2.19 J2.22 J2.25 J2.28 J2.31 J2.34 J2.37 J2.40 J2.43 J2.46 J2.49 J2.52 J2.55 J2.58 J3.1 J3.4 J3.7 J3.10 J3.13 J3.16 J3.19 J3.22 J3.25 J3.28 J3.31 J3.34 J3.37 J3.40 J3.43 J3.46 J3.49 J3.52 J3.55 J3.58 J4.1 J4.5 J4.7 J4.11 J4.14 J4.18 J4.20 J4.26 J4.30 J4.31 J4.34 J4.37 J4.40 J4.42 J4.44 J4.46 J4.49 J4.52 J4.54 J4.57 J4.60
BANK13_IO_L6: J4.10 ; off-sheet BANK13_IO_L6
BANK13_IO_L11_N: J1.33 ; off-sheet BANK13_IO_L11_N
BANK13_IO_L11_P: J1.32 ; off-sheet BANK13_IO_L11_P
BANK13_IO_L12_N: J1.36 ; off-sheet BANK13_IO_L12_N
BANK13_IO_L12_P: J1.35 ; off-sheet BANK13_IO_L12_P
BANK13_IO_L13_N: J1.39 ; off-sheet BANK13_IO_L13_N
BANK13_IO_L13_P: J1.38 ; off-sheet BANK13_IO_L13_P
BANK13_IO_L14_N: J1.42 ; off-sheet BANK13_IO_L14_N
BANK13_IO_L14_P: J1.41 ; off-sheet BANK13_IO_L14_P
BANK13_IO_L15_N: J1.45 ; off-sheet BANK13_IO_L15_N
BANK13_IO_L15_P: J1.44 ; off-sheet BANK13_IO_L15_P
BANK13_IO_L16_N: J1.48 ; off-sheet BANK13_IO_L16_N
BANK13_IO_L16_P: J1.47 ; off-sheet BANK13_IO_L16_P
BANK13_IO_L17_N: J1.51 ; off-sheet BANK13_IO_L17_N
BANK13_IO_L17_P: J1.50 ; off-sheet BANK13_IO_L17_P
BANK13_IO_L18_N: J1.54 ; off-sheet BANK13_IO_L18_N
BANK13_IO_L18_P: J1.53 ; off-sheet BANK13_IO_L18_P
BANK13_IO_L19_N: J1.57 ; off-sheet BANK13_IO_L19_N
BANK13_IO_L19_P: J1.56 ; off-sheet BANK13_IO_L19_P
BANK13_IO_L20_N: J1.60 ; off-sheet BANK13_IO_L20_N
BANK13_IO_L20_P: J1.59 ; off-sheet BANK13_IO_L20_P
BANK13_IO_L21_N: J1.15 ; off-sheet BANK13_IO_L21_N
BANK13_IO_L21_P: J1.14 ; off-sheet BANK13_IO_L21_P
BANK13_IO_L22_N: J1.18 ; off-sheet BANK13_IO_L22_N
BANK13_IO_L22_P: J1.17 ; off-sheet BANK13_IO_L22_P
BANK34_IO0: J4.8 ; off-sheet BANK34_IO0
BANK34_IO25: J4.9 ; off-sheet BANK34_IO25
BANK34_IO_L1_N: J3.33 ; off-sheet BANK34_IO_L1_N
BANK34_IO_L1_P: J3.32 ; off-sheet BANK34_IO_L1_P
BANK34_IO_L2_N: J3.36 ; off-sheet BANK34_IO_L2_N
BANK34_IO_L2_P: J3.35 ; off-sheet BANK34_IO_L2_P
BANK34_IO_L3_N: J3.39 ; off-sheet BANK34_IO_L3_N
BANK34_IO_L3_P: J3.38 ; off-sheet BANK34_IO_L3_P
BANK34_IO_L4_N: J3.42 ; off-sheet BANK34_IO_L4_N
BANK34_IO_L4_P: J3.41 ; off-sheet BANK34_IO_L4_P
BANK34_IO_L5_N: J3.45 ; off-sheet BANK34_IO_L5_N
BANK34_IO_L5_P: J3.44 ; off-sheet BANK34_IO_L5_P
BANK34_IO_L6_N: J3.48 ; off-sheet BANK34_IO_L6_N
BANK34_IO_L6_P: J3.47 ; off-sheet BANK34_IO_L6_P
BANK34_IO_L7_N: J3.51 ; off-sheet BANK34_IO_L7_N
BANK34_IO_L7_P: J3.50 ; off-sheet BANK34_IO_L7_P
BANK34_IO_L8_N: J3.54 ; off-sheet BANK34_IO_L8_N
BANK34_IO_L8_P: J3.53 ; off-sheet BANK34_IO_L8_P
BANK34_IO_L9_N: J3.57 ; off-sheet BANK34_IO_L9_N
BANK34_IO_L9_P: J3.56 ; off-sheet BANK34_IO_L9_P
BANK34_IO_L10_N: J3.60 ; off-sheet BANK34_IO_L10_N
BANK34_IO_L10_P: J3.59 ; off-sheet BANK34_IO_L10_P
BANK34_IO_L11_N: J3.3 ; off-sheet BANK34_IO_L11_N
BANK34_IO_L11_P: J3.2 ; off-sheet BANK34_IO_L11_P
BANK34_IO_L12_N: J3.6 ; off-sheet BANK34_IO_L12_N
BANK34_IO_L12_P: J3.5 ; off-sheet BANK34_IO_L12_P
BANK34_IO_L13_N: J3.9 ; off-sheet BANK34_IO_L13_N
BANK34_IO_L13_P: J3.8 ; off-sheet BANK34_IO_L13_P
BANK34_IO_L14_N: J3.12 ; off-sheet BANK34_IO_L14_N
BANK34_IO_L14_P: J3.11 ; off-sheet BANK34_IO_L14_P
BANK34_IO_L15_N: J3.15 ; off-sheet BANK34_IO_L15_N
BANK34_IO_L15_P: J3.14 ; off-sheet BANK34_IO_L15_P
BANK34_IO_L16_N: J3.18 ; off-sheet BANK34_IO_L16_N
BANK34_IO_L16_P: J3.17 ; off-sheet BANK34_IO_L16_P
BANK34_IO_L17_N: J3.21 ; off-sheet BANK34_IO_L17_N
BANK34_IO_L17_P: J3.20 ; off-sheet BANK34_IO_L17_P
BANK34_IO_L18_N: J3.24 ; off-sheet BANK34_IO_L18_N
BANK34_IO_L18_P: J3.23 ; off-sheet BANK34_IO_L18_P
BANK34_IO_L19_N: J3.27 ; off-sheet BANK34_IO_L19_N
BANK34_IO_L19_P: J3.26 ; off-sheet BANK34_IO_L19_P
BANK34_IO_L20_N: J3.30 ; off-sheet BANK34_IO_L20_N
BANK34_IO_L20_P: J3.29 ; off-sheet BANK34_IO_L20_P
BANK34_IO_L21_N: J1.21 ; off-sheet BANK34_IO_L21_N
BANK34_IO_L21_P: J1.20 ; off-sheet BANK34_IO_L21_P
BANK34_IO_L22_N: J1.24 ; off-sheet BANK34_IO_L22_N
BANK34_IO_L22_P: J1.23 ; off-sheet BANK34_IO_L22_P
BANK34_IO_L23_N: J1.27 ; off-sheet BANK34_IO_L23_N
BANK34_IO_L23_P: J1.26 ; off-sheet BANK34_IO_L23_P
BANK34_IO_L24_N: J1.30 ; off-sheet BANK34_IO_L24_N
BANK34_IO_L24_P: J1.29 ; off-sheet BANK34_IO_L24_P
BANK35_IO0: J1.2 ; off-sheet BANK35_IO0
BANK35_IO_25: J1.3 ; off-sheet BANK35_IO_25
BANK35_IO_L4_N: J4.12 ; off-sheet BANK35_IO_L4_N
BANK35_IO_L4_P: J4.13 ; off-sheet BANK35_IO_L4_P
BANK35_IO_L6_N: J2.54 ; off-sheet BANK35_IO_L6_N
BANK35_IO_L6_P: J2.53 ; off-sheet BANK35_IO_L6_P
BANK35_IO_L11_N: J2.57 ; off-sheet BANK35_IO_L11_N
BANK35_IO_L11_P: J2.56 ; off-sheet BANK35_IO_L11_P
BANK35_IO_L13_N: J2.60 ; off-sheet BANK35_IO_L13_N
BANK35_IO_L13_P: J2.59 ; off-sheet BANK35_IO_L13_P
BANK35_IO_L16_N: J1.12 ; off-sheet BANK35_IO_L16_N
BANK35_IO_L16_P: J1.11 ; off-sheet BANK35_IO_L16_P
BANK35_IO_L19_N: J1.8 ; off-sheet BANK35_IO_L19_N
BANK35_IO_L19_P: J1.9 ; off-sheet BANK35_IO_L19_P
BANK35_IO_L23_N: J1.6 ; off-sheet BANK35_IO_L23_N
BANK35_IO_L23_P: J1.5 ; off-sheet BANK35_IO_L23_P
ETH_INT_B: J4.3 ; off-sheet ETH_INT_B
ETH_MDC: J4.32 ; off-sheet ETH_MDC
ETH_MDIO: J4.33 ; off-sheet ETH_MDIO
ETH_RST_B: J4.4 ; off-sheet ETH_RST_B
ETH_RXCK: J4.41 ; off-sheet ETH_RXCK
ETH_RXCTL: J4.43 ; off-sheet ETH_RXCTL
ETH_RXD0: J4.35 ; off-sheet ETH_RXD0
ETH_RXD1: J4.36 ; off-sheet ETH_RXD1
ETH_RXD2: J4.38 ; off-sheet ETH_RXD2
ETH_RXD3: J4.39 ; off-sheet ETH_RXD3
ETH_TXCK: J4.53 ; off-sheet ETH_TXCK
ETH_TXCTL: J4.45 ; off-sheet ETH_TXCTL
ETH_TXD0: J4.47 ; off-sheet ETH_TXD0
ETH_TXD1: J4.48 ; off-sheet ETH_TXD1
ETH_TXD2: J4.50 ; off-sheet ETH_TXD2
ETH_TXD3: J4.51 ; off-sheet ETH_TXD3
HDMI_TX_SCL: J4.55 ; off-sheet HDMI_TX_SCL
HDMI_TX_SDA: J4.56 ; off-sheet HDMI_TX_SDA
OTG_CLK: J4.19 ; off-sheet OTG_CLK
OTG_DATA0: J4.25 ; off-sheet OTG_DATA0
OTG_DATA1: J4.24 ; off-sheet OTG_DATA1
OTG_DATA2: J4.23 ; off-sheet OTG_DATA2
OTG_DATA3: J4.22 ; off-sheet OTG_DATA3
OTG_DATA4: J4.21 ; off-sheet OTG_DATA4
OTG_DATA5: J4.17 ; off-sheet OTG_DATA5
OTG_DATA6: J4.16 ; off-sheet OTG_DATA6
OTG_DATA7: J4.15 ; off-sheet OTG_DATA7
OTG_DIR: J4.29 ; off-sheet OTG_DIR
OTG_NXT: J4.27 ; off-sheet OTG_NXT
OTG_OC: J4.2 ; off-sheet OTG_OC
OTG_RESETN: J4.6 ; off-sheet OTG_RESETN
OTG_STP: J4.28 ; off-sheet OTG_STP
XADC_AD0_N: J2.8 ; off-sheet XADC_AD0_N
XADC_AD0_P: J2.9 ; off-sheet XADC_AD0_P
XADC_AD1_N: J2.2 ; off-sheet XADC_AD1_N
XADC_AD1_P: J2.3 ; off-sheet XADC_AD1_P
XADC_AD2_N: J2.23 ; off-sheet XADC_AD2_N
XADC_AD2_P: J2.24 ; off-sheet XADC_AD2_P
XADC_AD3_N: J2.17 ; off-sheet XADC_AD3_N
XADC_AD3_P: J2.18 ; off-sheet XADC_AD3_P
XADC_AD4_N: J2.26 ; off-sheet XADC_AD4_N
XADC_AD4_P: J2.27 ; off-sheet XADC_AD4_P
XADC_AD5_N: J2.33 ; off-sheet XADC_AD5_N
XADC_AD5_P: J2.32 ; off-sheet XADC_AD5_P
XADC_AD6_N: J2.39 ; off-sheet XADC_AD6_N
XADC_AD6_P: J2.38 ; off-sheet XADC_AD6_P
XADC_AD7_N: J2.45 ; off-sheet XADC_AD7_N
XADC_AD7_P: J2.44 ; off-sheet XADC_AD7_P
XADC_AD8_N: J2.5 ; off-sheet XADC_AD8_N
XADC_AD8_P: J2.6 ; off-sheet XADC_AD8_P
XADC_AD9_N: J2.11 ; off-sheet XADC_AD9_N
XADC_AD9_P: J2.12 ; off-sheet XADC_AD9_P
XADC_AD10_N: J2.20 ; off-sheet XADC_AD10_N
XADC_AD10_P: J2.21 ; off-sheet XADC_AD10_P
XADC_AD11_N: J2.14 ; off-sheet XADC_AD11_N
XADC_AD11_P: J2.15 ; off-sheet XADC_AD11_P
XADC_AD12_N: J2.29 ; off-sheet XADC_AD12_N
XADC_AD12_P: J2.30 ; off-sheet XADC_AD12_P
XADC_AD13_N: J2.36 ; off-sheet XADC_AD13_N
XADC_AD13_P: J2.35 ; off-sheet XADC_AD13_P
XADC_AD14_N: J2.42 ; off-sheet XADC_AD14_N
XADC_AD14_P: J2.41 ; off-sheet XADC_AD14_P
XADC_AD15_N: J2.48 ; off-sheet XADC_AD15_N
XADC_AD15_P: J2.47 ; off-sheet XADC_AD15_P
XADC_V_N: J2.51 ; off-sheet XADC_V_N
XADC_V_P: J2.50 ; off-sheet XADC_V_P

### Library data of the parts
J1-J4 = 1-5177983-2: Connector; Manufacturer_Name: TE Connectivity; Datasheet Link: http://www.te.com/commerce/DocumentDelivery/DDEController?Action=srchrtrv&DocNm=5177983&DocType=Customer+Drawing&DocLang=English; Manufacturer_Part_Number: 1-5177983-2; Mouser Part Number: 571-1-5177983-2; Mouser Price/Stock: https://www.mouser.co.uk/ProductDetail/TE-Connectivity-AMP/1-5177983-2?qs=Xjc0wECptJC2XPkGv1w1ig%3D%3D; Arrow Part Number: 1-5177983-2; Arrow Price/Stock: https://www.arrow.com/en/products/1-5177983-2/te-connectivity

## Nets that join several sheets
0V675: ZYNQ-DDR3L (19 pins), Board-Power (C98.2 C99.2 U7.2 U7.4)
1V0: ZYNQ-Power (32 pins), Board-Power (8 pins)
1V8: ZYNQ-PS (18 pins), ZYNQ-Power (26 pins), Board-Power (10 pins), ZYNQ-Connecters (J4.59)
1V35: ZYNQ-Power (16 pins), ZYNQ-DDR3L (25 pins), Board-Power (14 pins)
3V3: ZYNQ-PS (16 pins), ZYNQ-Power (47 pins), ZYNQ-PL (C61.2 X2.4), ZYNQ-JTAG (25 pins), Board-Power (12 pins), ZYNQ-Connecters (J4.58)
5V0: ZYNQ-JTAG (D1.1), Board-Power (20 pins)
DDR3_VREF: ZYNQ-DDR3L (U1.H6 U1.P6 U2.H1 U2.M8), Board-Power (C92.2 C93.2 U7.8)
GND: ZYNQ-PS (41 pins), ZYNQ-Power (116 pins), ZYNQ-PL (C61.1 X2.2), ZYNQ-DDR3L (32 pins), ZYNQ-JTAG (42 pins), Board-Power (63 pins), Others (SP1.1 SP2.1 SP3.1 SP4.1), ZYNQ-Connecters (81 pins)
XADC1V8: ZYNQ-Power (U1.J9), Board-Power (C111.2 C112.2 FB3.2 U10.1)
XADCGND: ZYNQ-Power (U1.J10), ZYNQ-JTAG (U1.K10), Board-Power (6 pins)
XADCVREF: ZYNQ-JTAG (U1.L9), Board-Power (C113.2 C114.2 U10.2)
BANK13_IO_L6: ZYNQ-PL (U1.V5), ZYNQ-Connecters (J4.10)
BANK13_IO_L11_N: ZYNQ-PL (U1.V7), ZYNQ-Connecters (J1.33)
BANK13_IO_L11_P: ZYNQ-PL (U1.U7), ZYNQ-Connecters (J1.32)
BANK13_IO_L12_N: ZYNQ-PL (U1.U10), ZYNQ-Connecters (J1.36)
BANK13_IO_L12_P: ZYNQ-PL (U1.T9), ZYNQ-Connecters (J1.35)
BANK13_IO_L13_N: ZYNQ-PL (U1.Y6), ZYNQ-Connecters (J1.39)
BANK13_IO_L13_P: ZYNQ-PL (U1.Y7), ZYNQ-Connecters (J1.38)
BANK13_IO_L14_N: ZYNQ-PL (U1.Y8), ZYNQ-Connecters (J1.42)
BANK13_IO_L14_P: ZYNQ-PL (U1.Y9), ZYNQ-Connecters (J1.41)
BANK13_IO_L15_N: ZYNQ-PL (U1.W8), ZYNQ-Connecters (J1.45)
BANK13_IO_L15_P: ZYNQ-PL (U1.V8), ZYNQ-Connecters (J1.44)
BANK13_IO_L16_N: ZYNQ-PL (U1.W9), ZYNQ-Connecters (J1.48)
BANK13_IO_L16_P: ZYNQ-PL (U1.W10), ZYNQ-Connecters (J1.47)
BANK13_IO_L17_N: ZYNQ-PL (U1.U8), ZYNQ-Connecters (J1.51)
BANK13_IO_L17_P: ZYNQ-PL (U1.U9), ZYNQ-Connecters (J1.50)
BANK13_IO_L18_N: ZYNQ-PL (U1.Y11), ZYNQ-Connecters (J1.54)
BANK13_IO_L18_P: ZYNQ-PL (U1.W11), ZYNQ-Connecters (J1.53)
BANK13_IO_L19_N: ZYNQ-PL (U1.U5), ZYNQ-Connecters (J1.57)
BANK13_IO_L19_P: ZYNQ-PL (U1.T5), ZYNQ-Connecters (J1.56)
BANK13_IO_L20_N: ZYNQ-PL (U1.Y13), ZYNQ-Connecters (J1.60)
BANK13_IO_L20_P: ZYNQ-PL (U1.Y12), ZYNQ-Connecters (J1.59)
BANK13_IO_L21_N: ZYNQ-PL (U1.V10), ZYNQ-Connecters (J1.15)
BANK13_IO_L21_P: ZYNQ-PL (U1.V11), ZYNQ-Connecters (J1.14)
BANK13_IO_L22_N: ZYNQ-PL (U1.W6), ZYNQ-Connecters (J1.18)
BANK13_IO_L22_P: ZYNQ-PL (U1.V6), ZYNQ-Connecters (J1.17)
BANK34_IO0: ZYNQ-PL (U1.R19), ZYNQ-Connecters (J4.8)
BANK34_IO25: ZYNQ-PL (U1.T19), ZYNQ-Connecters (J4.9)
BANK34_IO_L1_N: ZYNQ-PL (U1.T10), ZYNQ-Connecters (J3.33)
BANK34_IO_L1_P: ZYNQ-PL (U1.T11), ZYNQ-Connecters (J3.32)
BANK34_IO_L2_N: ZYNQ-PL (U1.U12), ZYNQ-Connecters (J3.36)
BANK34_IO_L2_P: ZYNQ-PL (U1.T12), ZYNQ-Connecters (J3.35)
BANK34_IO_L3_N: ZYNQ-PL (U1.V13), ZYNQ-Connecters (J3.39)
BANK34_IO_L3_P: ZYNQ-PL (U1.U13), ZYNQ-Connecters (J3.38)
BANK34_IO_L4_N: ZYNQ-PL (U1.W13), ZYNQ-Connecters (J3.42)
BANK34_IO_L4_P: ZYNQ-PL (U1.V12), ZYNQ-Connecters (J3.41)
BANK34_IO_L5_N: ZYNQ-PL (U1.T15), ZYNQ-Connecters (J3.45)
BANK34_IO_L5_P: ZYNQ-PL (U1.T14), ZYNQ-Connecters (J3.44)
BANK34_IO_L6_N: ZYNQ-PL (U1.R14), ZYNQ-Connecters (J3.48)
BANK34_IO_L6_P: ZYNQ-PL (U1.P14), ZYNQ-Connecters (J3.47)
BANK34_IO_L7_N: ZYNQ-PL (U1.Y17), ZYNQ-Connecters (J3.51)
BANK34_IO_L7_P: ZYNQ-PL (U1.Y16), ZYNQ-Connecters (J3.50)
BANK34_IO_L8_N: ZYNQ-PL (U1.Y14), ZYNQ-Connecters (J3.54)
BANK34_IO_L8_P: ZYNQ-PL (U1.W14), ZYNQ-Connecters (J3.53)
BANK34_IO_L9_N: ZYNQ-PL (U1.U17), ZYNQ-Connecters (J3.57)
BANK34_IO_L9_P: ZYNQ-PL (U1.T16), ZYNQ-Connecters (J3.56)
BANK34_IO_L10_N: ZYNQ-PL (U1.W15), ZYNQ-Connecters (J3.60)
BANK34_IO_L10_P: ZYNQ-PL (U1.V15), ZYNQ-Connecters (J3.59)
BANK34_IO_L11_N: ZYNQ-PL (U1.U15), ZYNQ-Connecters (J3.3)
BANK34_IO_L11_P: ZYNQ-PL (U1.U14), ZYNQ-Connecters (J3.2)
BANK34_IO_L12_N: ZYNQ-PL (U1.U19), ZYNQ-Connecters (J3.6)
BANK34_IO_L12_P: ZYNQ-PL (U1.U18), ZYNQ-Connecters (J3.5)
BANK34_IO_L13_N: ZYNQ-PL (U1.P19), ZYNQ-Connecters (J3.9)
BANK34_IO_L13_P: ZYNQ-PL (U1.N18), ZYNQ-Connecters (J3.8)
BANK34_IO_L14_N: ZYNQ-PL (U1.P20), ZYNQ-Connecters (J3.12)
BANK34_IO_L14_P: ZYNQ-PL (U1.N20), ZYNQ-Connecters (J3.11)
BANK34_IO_L15_N: ZYNQ-PL (U1.U20), ZYNQ-Connecters (J3.15)
BANK34_IO_L15_P: ZYNQ-PL (U1.T20), ZYNQ-Connecters (J3.14)
BANK34_IO_L16_N: ZYNQ-PL (U1.W20), ZYNQ-Connecters (J3.18)
BANK34_IO_L16_P: ZYNQ-PL (U1.V20), ZYNQ-Connecters (J3.17)
BANK34_IO_L17_N: ZYNQ-PL (U1.Y19), ZYNQ-Connecters (J3.21)
BANK34_IO_L17_P: ZYNQ-PL (U1.Y18), ZYNQ-Connecters (J3.20)
BANK34_IO_L18_N: ZYNQ-PL (U1.W16), ZYNQ-Connecters (J3.24)
BANK34_IO_L18_P: ZYNQ-PL (U1.V16), ZYNQ-Connecters (J3.23)
BANK34_IO_L19_N: ZYNQ-PL (U1.R17), ZYNQ-Connecters (J3.27)
BANK34_IO_L19_P: ZYNQ-PL (U1.R16), ZYNQ-Connecters (J3.26)
BANK34_IO_L20_N: ZYNQ-PL (U1.R18), ZYNQ-Connecters (J3.30)
BANK34_IO_L20_P: ZYNQ-PL (U1.T17), ZYNQ-Connecters (J3.29)
BANK34_IO_L21_N: ZYNQ-PL (U1.V18), ZYNQ-Connecters (J1.21)
BANK34_IO_L21_P: ZYNQ-PL (U1.V17), ZYNQ-Connecters (J1.20)
BANK34_IO_L22_N: ZYNQ-PL (U1.W19), ZYNQ-Connecters (J1.24)
BANK34_IO_L22_P: ZYNQ-PL (U1.W18), ZYNQ-Connecters (J1.23)
BANK34_IO_L23_N: ZYNQ-PL (U1.P18), ZYNQ-Connecters (J1.27)
BANK34_IO_L23_P: ZYNQ-PL (U1.N17), ZYNQ-Connecters (J1.26)
BANK34_IO_L24_N: ZYNQ-PL (U1.P16), ZYNQ-Connecters (J1.30)
BANK34_IO_L24_P: ZYNQ-PL (U1.P15), ZYNQ-Connecters (J1.29)
BANK35_IO0: ZYNQ-PL (U1.G14), ZYNQ-Connecters (J1.2)
BANK35_IO_25: ZYNQ-PL (U1.J15), ZYNQ-Connecters (J1.3)
BANK35_IO_L4_N: ZYNQ-PL (U1.D20), ZYNQ-Connecters (J4.12)
BANK35_IO_L4_P: ZYNQ-PL (U1.D19), ZYNQ-Connecters (J4.13)
BANK35_IO_L6_N: ZYNQ-PL (U1.F17), ZYNQ-Connecters (J2.54)
BANK35_IO_L6_P: ZYNQ-PL (U1.F16), ZYNQ-Connecters (J2.53)
BANK35_IO_L11_N: ZYNQ-PL (U1.L17), ZYNQ-Connecters (J2.57)
BANK35_IO_L11_P: ZYNQ-PL (U1.L16), ZYNQ-Connecters (J2.56)
BANK35_IO_L13_N: ZYNQ-PL (U1.H17), ZYNQ-Connecters (J2.60)
BANK35_IO_L13_P: ZYNQ-PL (U1.H16), ZYNQ-Connecters (J2.59)
BANK35_IO_L16_N: ZYNQ-PL (U1.G18), ZYNQ-Connecters (J1.12)
BANK35_IO_L16_P: ZYNQ-PL (U1.G17), ZYNQ-Connecters (J1.11)
BANK35_IO_L19_N: ZYNQ-PL (U1.G15), ZYNQ-Connecters (J1.8)
BANK35_IO_L19_P: ZYNQ-PL (U1.H15), ZYNQ-Connecters (J1.9)
BANK35_IO_L23_N: ZYNQ-PL (U1.M15), ZYNQ-Connecters (J1.6)
BANK35_IO_L23_P: ZYNQ-PL (U1.M14), ZYNQ-Connecters (J1.5)
ETH_INT_B: ZYNQ-PS (U1.E9), ZYNQ-Connecters (J4.3)
ETH_MDC: ZYNQ-PS (U1.C10), ZYNQ-Connecters (J4.32)
ETH_MDIO: ZYNQ-PS (U1.C11), ZYNQ-Connecters (J4.33)
ETH_RST_B: ZYNQ-PS (U1.B5), ZYNQ-Connecters (J4.4)
ETH_RXCK: ZYNQ-PS (U1.B17), ZYNQ-Connecters (J4.41)
ETH_RXCTL: ZYNQ-PS (U1.D13), ZYNQ-Connecters (J4.43)
ETH_RXD0: ZYNQ-PS (U1.D11), ZYNQ-Connecters (J4.35)
ETH_RXD1: ZYNQ-PS (U1.A16), ZYNQ-Connecters (J4.36)
ETH_RXD2: ZYNQ-PS (U1.F15), ZYNQ-Connecters (J4.38)
ETH_RXD3: ZYNQ-PS (U1.A15), ZYNQ-Connecters (J4.39)
ETH_TXCK: ZYNQ-PS (U1.A19), ZYNQ-Connecters (J4.53)
ETH_TXCTL: ZYNQ-PS (U1.F14), ZYNQ-Connecters (J4.45)
ETH_TXD0: ZYNQ-PS (U1.E14), ZYNQ-Connecters (J4.47)
ETH_TXD1: ZYNQ-PS (U1.B18), ZYNQ-Connecters (J4.48)
ETH_TXD2: ZYNQ-PS (U1.D10), ZYNQ-Connecters (J4.50)
ETH_TXD3: ZYNQ-PS (U1.A17), ZYNQ-Connecters (J4.51)
FT2232_UART_RX: ZYNQ-PS (R42.1), ZYNQ-JTAG (U3.39)
FT2232_UART_TX: ZYNQ-PS (R41.1), ZYNQ-JTAG (U3.38)
HDMI_TX_SCL: ZYNQ-PS (U1.B13), ZYNQ-Connecters (J4.55)
HDMI_TX_SDA: ZYNQ-PS (U1.B9), ZYNQ-Connecters (J4.56)
OTG_CLK: ZYNQ-PS (R103.1), ZYNQ-Connecters (J4.19)
OTG_DATA0: ZYNQ-PS (U1.A14), ZYNQ-Connecters (J4.25)
OTG_DATA1: ZYNQ-PS (U1.D15), ZYNQ-Connecters (J4.24)
OTG_DATA2: ZYNQ-PS (U1.A12), ZYNQ-Connecters (J4.23)
OTG_DATA3: ZYNQ-PS (U1.F12), ZYNQ-Connecters (J4.22)
OTG_DATA4: ZYNQ-PS (U1.C16), ZYNQ-Connecters (J4.21)
OTG_DATA5: ZYNQ-PS (U1.A10), ZYNQ-Connecters (J4.17)
OTG_DATA6: ZYNQ-PS (U1.E13), ZYNQ-Connecters (J4.16)
OTG_DATA7: ZYNQ-PS (U1.C18), ZYNQ-Connecters (J4.15)
OTG_DIR: ZYNQ-PS (U1.C13), ZYNQ-Connecters (J4.29)
OTG_NXT: ZYNQ-PS (U1.E16), ZYNQ-Connecters (J4.27)
OTG_OC: ZYNQ-PS (U1.C6), ZYNQ-Connecters (J4.2)
OTG_RESETN: ZYNQ-PS (U1.D16), ZYNQ-Connecters (J4.6)
OTG_STP: ZYNQ-PS (U1.C15), ZYNQ-Connecters (J4.28)
PG_3V3: ZYNQ-PS (U1.C7), Board-Power (C146.1 R98.1 U12.1)
XADC_AD0_N: ZYNQ-PL (U1.B20), ZYNQ-Connecters (J2.8)
XADC_AD0_P: ZYNQ-PL (U1.C20), ZYNQ-Connecters (J2.9)
XADC_AD1_N: ZYNQ-PL (U1.D18), ZYNQ-Connecters (J2.2)
XADC_AD1_P: ZYNQ-PL (U1.E17), ZYNQ-Connecters (J2.3)
XADC_AD2_N: ZYNQ-PL (U1.M20), ZYNQ-Connecters (J2.23)
XADC_AD2_P: ZYNQ-PL (U1.M19), ZYNQ-Connecters (J2.24)
XADC_AD3_N: ZYNQ-PL (U1.L20), ZYNQ-Connecters (J2.17)
XADC_AD3_P: ZYNQ-PL (U1.L19), ZYNQ-Connecters (J2.18)
XADC_AD4_N: ZYNQ-PL (U1.H18), ZYNQ-Connecters (J2.26)
XADC_AD4_P: ZYNQ-PL (U1.J18), ZYNQ-Connecters (J2.27)
XADC_AD5_N: ZYNQ-PL (U1.H20), ZYNQ-Connecters (J2.33)
XADC_AD5_P: ZYNQ-PL (U1.J20), ZYNQ-Connecters (J2.32)
XADC_AD6_N: ZYNQ-PL (U1.J14), ZYNQ-Connecters (J2.39)
XADC_AD6_P: ZYNQ-PL (U1.K14), ZYNQ-Connecters (J2.38)
XADC_AD7_N: ZYNQ-PL (U1.L15), ZYNQ-Connecters (J2.45)
XADC_AD7_P: ZYNQ-PL (U1.L14), ZYNQ-Connecters (J2.44)
XADC_AD8_N: ZYNQ-PL (U1.A20), ZYNQ-Connecters (J2.5)
XADC_AD8_P: ZYNQ-PL (U1.B19), ZYNQ-Connecters (J2.6)
XADC_AD9_N: ZYNQ-PL (U1.E19), ZYNQ-Connecters (J2.11)
XADC_AD9_P: ZYNQ-PL (U1.E18), ZYNQ-Connecters (J2.12)
XADC_AD10_N: ZYNQ-PL (U1.M18), ZYNQ-Connecters (J2.20)
XADC_AD10_P: ZYNQ-PL (U1.M17), ZYNQ-Connecters (J2.21)
XADC_AD11_N: ZYNQ-PL (U1.J19), ZYNQ-Connecters (J2.14)
XADC_AD11_P: ZYNQ-PL (U1.K19), ZYNQ-Connecters (J2.15)
XADC_AD12_N: ZYNQ-PL (U1.F20), ZYNQ-Connecters (J2.29)
XADC_AD12_P: ZYNQ-PL (U1.F19), ZYNQ-Connecters (J2.30)
XADC_AD13_N: ZYNQ-PL (U1.G20), ZYNQ-Connecters (J2.36)
XADC_AD13_P: ZYNQ-PL (U1.G19), ZYNQ-Connecters (J2.35)
XADC_AD14_N: ZYNQ-PL (U1.N16), ZYNQ-Connecters (J2.42)
XADC_AD14_P: ZYNQ-PL (U1.N15), ZYNQ-Connecters (J2.41)
XADC_AD15_N: ZYNQ-PL (U1.J16), ZYNQ-Connecters (J2.48)
XADC_AD15_P: ZYNQ-PL (U1.K16), ZYNQ-Connecters (J2.47)
XADC_V_N: ZYNQ-JTAG (U1.L10), ZYNQ-Connecters (J2.51)
XADC_V_P: ZYNQ-JTAG (U1.K9), ZYNQ-Connecters (J2.50)